# Altium schematic sheet Youtube_Motherboard.SchDoc
size A4; SheetNumber: 1; SheetTotal: 1
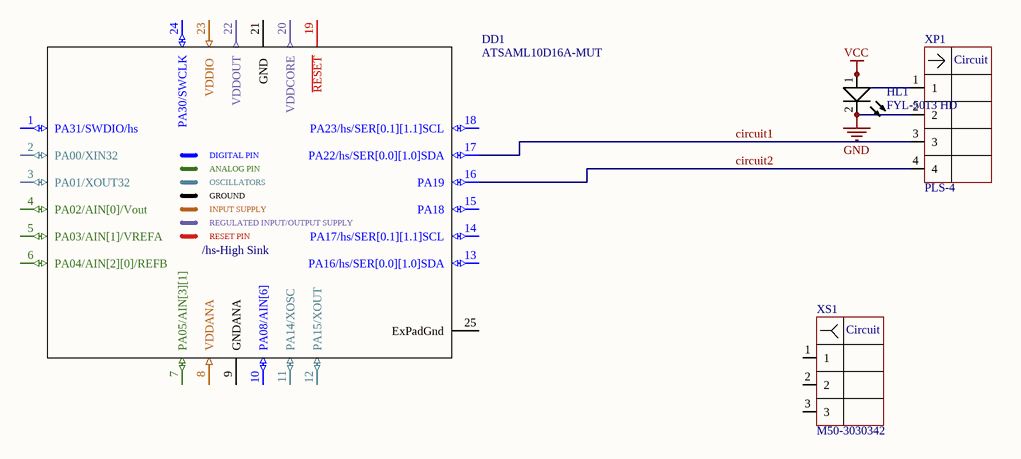
[diagram p0: Youtube_Motherboard.SchDoc]

## Parts
DD1  ATSAML10D16A-MUT  [VQFN-24]
HL1  FYL-5013 HD  [LED_3MM_RED]
XP1  PLS-4  [PLS-4-3D]
XS1  M50-3030342  [PBLS-1.27-3]

## Nets
GND: HL1.2(K) XP1.2
VCC: HL1.1(A) XP1.1
circuit1: DD1.17(PA22/hs/SER[0.0][1.0]SDA) XP1.3
circuit2: DD1.16(PA19) XP1.4

Not connected (* = marked no-connect by the designer): DD1 1(PA31/SWDIO/hs) 2(PA00/XIN32) 3(PA01/XOUT32) 4(PA02/AIN[0]/Vout) 5(PA03/AIN[1]/VREFA) 6(PA04/AIN[2][0]/REFB) 7(PA05/AIN[3][1]) 8(VDDANA) 9(GNDANA) 10(PA08/AIN[6]) 11(PA14/XOSC) 12(PA15/XOUT) 13(PA16/hs/SER[0.0][1.0]SDA) 14(PA17/hs/SER[0.1][1.1]SCL) 15(PA18) 18(PA23/hs/SER[0.1][1.1]SCL) 19(~{RESET}) 20(VDDCORE) 21(GND_) 22(VDDOUT) 23(VDDIO_) 24(PA30/SWCLK) 25(ExPadGnd); XS1 1 2 3

## Notes on the sheet
- (in symbol ATSAML10D16A-MUT) DIGITAL PIN; ANALOG PIN; OSCILLATORS; GROUND; INPUT SUPPLY; REGULATED INPUT/OUTPUT SUPPLY; RESET PIN; /hs-High Sink
- (in symbol G800W304018EU) Circuit
- (in symbol M50-3030342) Circuit

## Library data of the parts
DD1 = ATSAML10D16A-MUT: IC MCU 32BIT 64KB FLASH 24VQFN,ARM® Cortex®-M23; Part Number: ATSAML10D16A-MUT; HelpURL: https://www.digikey.com/product-detail/en/microchip-technology/ATSAML10D16A-MUT/ATSAML10D16A-MUTCT-ND/9360576; Price$: 1.82; Digi-Key Part Number: ATSAML10D16A-MUTCT-ND; Manufacturer Part Number: ATSAML10D16A-MUT; Package: VQFN-24
XP1 = G800W304018EU: Headers & Wire Housings Pin Header 2.54mm Pitch STR DIP,1x4Pin,FULL G/F,NY6T,6.1mm*2.5mm*3.0mm,Color-Black,BAG; System: Connector; Part Number: G800W304018EU; HelpURL: https://www.mouser.com/ProductDetail/Amphenol-Commercial-Products/G800W304018EU?qs=f9yNj16SXrKi9QS16pMdvA%3D%3D; Price$: 0.042; Manufacturer Part Number: G800W304018EU; Package: Header 4POS 2.54mm; Mouser Part Number: 523-G800W304018EU
XS1 = M50-3030342: Headers & Wire Housings 3 WAY SIL VERT PC TAIL SKT; Part Number: M50-3030342; HelpURL: https://eu.mouser.com/ProductDetail/Harwin/M50-3030342?qs=sGAEpiMZZMs%252BGHln7q6pm8Vn94ktop%2FJCT2ZrMcJQ%2F%2FaTd%2FpiUltJA%3D%3D; Price$: 0.306; Manufacturer Part Number: M50-3030342; Mouser Part Number: 855-M50-3030342
HL1 = FYL-5013 HD: Part Number: FYL-5013 HD